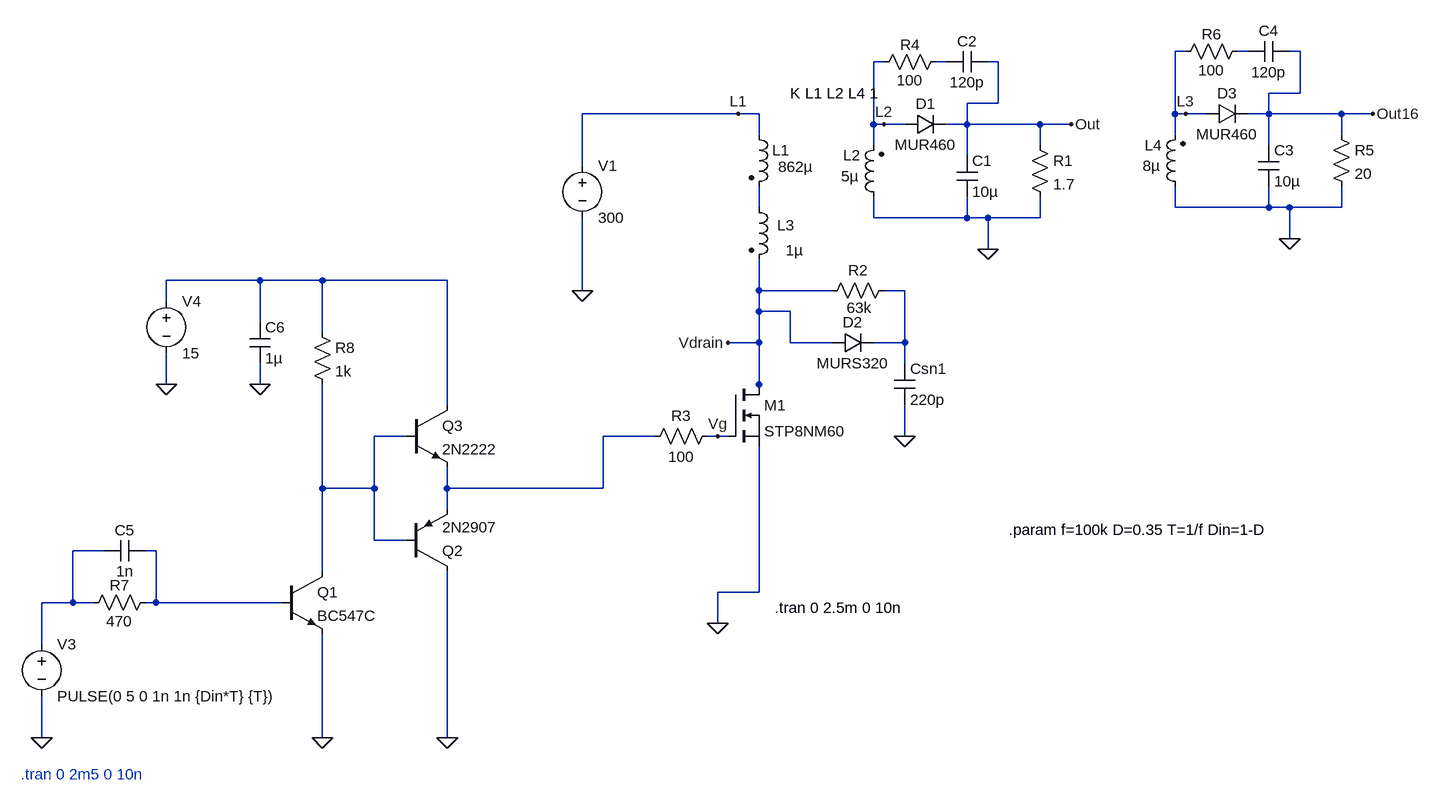
[diagram p0: schematic Flyback_caso1_con_gap.asc]
Flyback_caso1_con_gap.asc, the LTspice schematic file:
Version 4
SHEET 1 1368 1032
WIRE 992 -96 976 -96
WIRE 1088 -96 1072 -96
WIRE 1168 -96 1152 -96
WIRE 528 -80 512 -80
WIRE 624 -80 608 -80
WIRE 704 -80 688 -80
WIRE 1168 -32 1168 -96
WIRE 1168 -32 1120 -32
WIRE 704 -16 704 -80
WIRE 704 -16 656 -16
WIRE 304 0 64 0
WIRE 336 0 304 0
WIRE 976 0 976 -96
WIRE 992 0 976 0
WIRE 1024 0 992 0
WIRE 1120 0 1120 -32
WIRE 1120 0 1088 0
WIRE 1232 0 1120 0
WIRE 1280 0 1232 0
WIRE 512 16 512 -80
WIRE 528 16 512 16
WIRE 560 16 528 16
WIRE 656 16 656 -16
WIRE 656 16 624 16
WIRE 768 16 656 16
WIRE 816 16 768 16
WIRE 336 32 336 0
WIRE 976 32 976 0
WIRE 1232 32 1232 0
WIRE 512 48 512 16
WIRE 768 48 768 16
WIRE 1120 48 1120 0
WIRE 656 64 656 16
WIRE 64 80 64 0
WIRE 336 144 336 112
WIRE 976 144 976 112
WIRE 1120 144 1120 112
WIRE 1120 144 976 144
WIRE 1152 144 1120 144
WIRE 1232 144 1232 112
WIRE 1232 144 1152 144
WIRE 512 160 512 128
WIRE 656 160 656 128
WIRE 656 160 512 160
WIRE 688 160 656 160
WIRE 768 160 768 128
WIRE 768 160 688 160
WIRE 1152 192 1152 144
WIRE 688 208 688 160
WIRE -432 256 -576 256
WIRE -336 256 -432 256
WIRE -144 256 -336 256
WIRE 64 272 64 160
WIRE 336 272 336 224
WIRE 448 272 336 272
WIRE 560 272 528 272
WIRE -576 288 -576 256
WIRE 336 304 336 272
WIRE 384 304 336 304
WIRE -432 320 -432 256
WIRE -336 336 -336 256
WIRE 336 352 336 304
WIRE 336 352 288 352
WIRE 384 352 384 304
WIRE 448 352 384 352
WIRE 560 352 560 272
WIRE 560 352 512 352
WIRE 560 384 560 352
WIRE -576 416 -576 368
WIRE -432 416 -432 384
WIRE 336 416 336 352
WIRE 336 432 336 416
WIRE -144 448 -144 256
WIRE -208 496 -256 496
WIRE 176 496 96 496
WIRE 272 496 256 496
WIRE 288 496 272 496
WIRE 560 496 560 448
WIRE -336 576 -336 416
WIRE -256 576 -256 496
WIRE -256 576 -336 576
WIRE -144 576 -144 544
WIRE 96 576 96 496
WIRE 96 576 -144 576
WIRE -144 608 -144 576
WIRE -256 656 -256 576
WIRE -208 656 -256 656
WIRE -672 672 -720 672
WIRE -592 672 -608 672
WIRE -336 704 -336 576
WIRE 336 736 336 512
WIRE 336 736 272 736
WIRE -720 752 -720 672
WIRE -720 752 -768 752
WIRE -688 752 -720 752
WIRE -592 752 -592 672
WIRE -592 752 -608 752
WIRE -400 752 -592 752
WIRE 272 784 272 736
WIRE -768 816 -768 752
WIRE -768 960 -768 896
WIRE -336 960 -336 800
WIRE -144 960 -144 704
FLAG 272 784 0
FLAG 688 208 0
FLAG 560 496 0
FLAG 288 352 Vdrain
FLAG 272 496 Vg
FLAG 304 0 L1
FLAG 528 16 L2
FLAG 816 16 Out
FLAG 1152 192 0
FLAG 992 0 L3
FLAG 1280 0 Out16
FLAG -432 416 0
FLAG -576 416 0
FLAG -768 960 0
FLAG -336 960 0
FLAG -144 960 0
FLAG 64 272 0
SYMBOL ind2 320 16 R0
WINDOW 3 45 65 Left 2
SYMATTR Value 862µ
SYMATTR InstName L1
SYMATTR Type ind
SYMBOL ind2 528 144 R180
WINDOW 0 36 80 Left 2
WINDOW 3 39 48 Left 2
SYMATTR InstName L2
SYMATTR Value 5µ
SYMATTR Type ind
SYMBOL voltage 64 64 R0
WINDOW 123 0 0 Left 0
WINDOW 39 0 0 Left 0
SYMATTR InstName V1
SYMATTR Value 300
SYMBOL cap 640 64 R0
SYMATTR InstName C1
SYMATTR Value 10µ
SYMBOL diode 560 32 R270
WINDOW 0 32 32 VTop 2
WINDOW 3 0 32 VBottom 2
SYMATTR InstName D1
SYMATTR Value MUR460
SYMBOL res 752 32 R0
SYMATTR InstName R1
SYMATTR Value 1.7
SYMBOL res 544 256 R90
WINDOW 0 0 56 VBottom 2
WINDOW 3 27 54 VTop 2
SYMATTR InstName R2
SYMATTR Value 63k
SYMBOL diode 448 368 R270
WINDOW 0 32 32 VTop 2
WINDOW 3 0 32 VBottom 2
SYMATTR InstName D2
SYMATTR Value MURS320
SYMBOL cap 544 384 R0
SYMATTR InstName Csn1
SYMATTR Value 220p
SYMBOL nmos 288 416 R0
SYMATTR InstName M1
SYMATTR Value STP8NM60
SYMBOL ind2 320 128 R0
WINDOW 0 71 43 Right 2
WINDOW 3 70 82 Center 2
SYMATTR InstName L3
SYMATTR Value 1µ
SYMATTR Type ind
SYMBOL res 272 480 R90
WINDOW 0 0 56 VBottom 2
WINDOW 3 32 56 VTop 2
SYMATTR InstName R3
SYMATTR Value 100
SYMBOL res 512 -64 R270
WINDOW 0 27 56 VTop 2
WINDOW 3 3 56 VBottom 2
SYMATTR InstName R4
SYMATTR Value 100
SYMBOL cap 624 -64 R270
WINDOW 0 32 32 VTop 2
WINDOW 3 0 32 VBottom 2
SYMATTR InstName C2
SYMATTR Value 120p
SYMBOL ind2 992 128 R180
WINDOW 0 36 80 Left 2
WINDOW 3 39 48 Left 2
SYMATTR InstName L4
SYMATTR Value 8µ
SYMATTR Type ind
SYMBOL cap 1104 48 R0
SYMATTR InstName C3
SYMATTR Value 10µ
SYMBOL diode 1024 16 R270
WINDOW 0 32 32 VTop 2
WINDOW 3 0 32 VBottom 2
SYMATTR InstName D3
SYMATTR Value MUR460
SYMBOL res 1216 16 R0
SYMATTR InstName R5
SYMATTR Value 20
SYMBOL res 976 -80 R270
WINDOW 0 27 56 VTop 2
WINDOW 3 3 56 VBottom 2
SYMATTR InstName R6
SYMATTR Value 100
SYMBOL cap 1088 -80 R270
WINDOW 0 32 32 VTop 2
WINDOW 3 0 32 VBottom 2
SYMATTR InstName C4
SYMATTR Value 120p
SYMBOL npn -400 704 R0
SYMATTR InstName Q1
SYMATTR Value BC547C
SYMBOL pnp -208 704 M180
SYMATTR InstName Q2
SYMATTR Value 2N2907
SYMBOL npn -208 448 R0
SYMATTR InstName Q3
SYMATTR Value 2N2222
SYMBOL voltage -768 800 R0
WINDOW 123 0 0 Left 0
WINDOW 39 0 0 Left 0
SYMATTR InstName V3
SYMATTR Value PULSE(0 5 0 1n 1n {Din*T} {T})
SYMBOL res -704 768 R270
WINDOW 0 27 56 VTop 2
WINDOW 3 3 56 VBottom 2
SYMATTR InstName R7
SYMATTR Value 470
SYMBOL cap -672 688 R270
WINDOW 0 32 32 VTop 2
WINDOW 3 0 32 VBottom 2
SYMATTR InstName C5
SYMATTR Value 1n
SYMBOL res -352 320 R0
SYMATTR InstName R8
SYMATTR Value 1k
SYMBOL cap -448 320 R0
SYMATTR InstName C6
SYMATTR Value 1µ
SYMBOL voltage -576 272 R0
WINDOW 123 0 0 Left 0
WINDOW 39 0 0 Left 0
SYMATTR InstName V4
SYMATTR Value 15
TEXT 384 -32 Left 2 !K L1 L2 L4 1
TEXT 360 760 Left 2 !.tran 0 2.5m 0 10n
TEXT -800 1016 Left 2 ;.tran 0 2m5 0 10n
TEXT 720 640 Left 2 !.param f=100k D=0.35 T=1/f Din=1-D

The netlist it stands for:
* Flyback_caso1_con_gap.asc
L1 L1 N003 862µ
L2 0 L2 5µ
V1 L1 0 300
C1 Out 0 10µ
D1 L2 Out MUR460
R1 Out 0 1.7
R2 N005 Vdrain 63k
D2 Vdrain N005 MURS320
Csn1 N005 0 220p
M1 Vdrain Vg 0 0 STP8NM60
L3 N003 Vdrain 1µ
R3 Vg N007 100
R4 L2 N002 100
C2 N002 Out 120p
L4 0 L3 8µ
C3 Out16 0 10µ
D3 L3 Out16 MUR460
R5 Out16 0 20
R6 L3 N001 100
C4 N001 Out16 120p
Q1 N006 N009 0 0 BC547C
Q2 0 N006 N007 0 2N2907
Q3 N004 N006 N007 0 2N2222
V3 N008 0 PULSE(0 5 0 1n 1n {Din*T} {T})
R7 N008 N009 470
C5 N008 N009 1n
R8 N004 N006 1k
C6 N004 0 1µ
V4 N004 0 15
.model D D
.lib standard.dio
.model NPN NPN
.model PNP PNP
.lib standard.bjt
.model NMOS NMOS
.model PMOS PMOS
.lib standard.mos
K L1 L2 L4 1
.tran 0 2.5m 0 10n
* .tran 0 2m5 0 10n
.param f=100k D=0.35 T=1/f Din=1-D
.backanno
.end